# Altium project RX_V1.0.PrjPcb
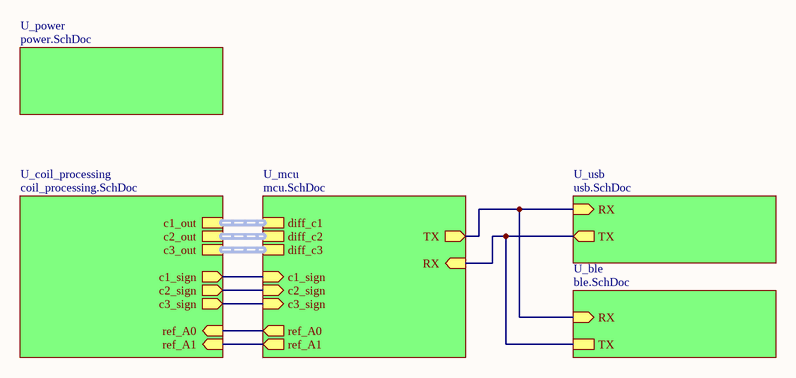
[diagram p0: rx.SchDoc]
8 sheets, 154 parts. Net scope: hierarchical (ports join the sheet entries above them; power ports are global).
Board file: RX.PcbDoc
Sheets:
  rx.SchDoc
    U_power = power.SchDoc
    U_mcu = mcu.SchDoc
      U_imu = imu.SchDoc
    U_coil_processing = coil_processing.SchDoc
      c1 = coils.SchDoc
      c2 = coils.SchDoc
      c3 = coils.SchDoc
    U_usb = usb.SchDoc
    U_ble = ble.SchDoc

## Sheet rx.SchDoc
size A

### Sub-sheets
U_ble = ble.SchDoc: RX (in), TX
U_coil_processing = coil_processing.SchDoc: c2_out (harness diff_signal), c3_sign (out), c2_sign (out), c3_out (harness diff_signal), c1_sign (out), c1_out (harness diff_signal), ref_A0 (in), ref_A1 (in)
U_mcu = mcu.SchDoc: diff_c1 (harness diff_signal), diff_c2 (harness diff_signal), diff_c3 (harness diff_signal), c1_sign (in), c2_sign (in), c3_sign (in), ref_A0 (out), ref_A1 (out), TX (out), RX (in)
U_power = power.SchDoc: no entries
U_usb = usb.SchDoc: TX (out), RX (in)

### Nets
RX: sheet U_mcu/RX, sheet U_usb/TX, sheet U_ble/TX
TX: sheet U_mcu/TX, sheet U_usb/RX, sheet U_ble/RX
NetRp1_1: sheet U_mcu/c1_sign, sheet U_coil_processing/c1_sign
NetRp2_1: sheet U_mcu/c2_sign, sheet U_coil_processing/c2_sign
NetRp3_1: sheet U_mcu/c3_sign, sheet U_coil_processing/c3_sign
NetU3_29: sheet U_mcu/ref_A0, sheet U_coil_processing/ref_A0
NetU3_30: sheet U_mcu/ref_A1, sheet U_coil_processing/ref_A1

### Buses and harness runs
harness sheet U_coil_processing/c1_out = sheet U_mcu/diff_c1
harness sheet U_coil_processing/c2_out = sheet U_mcu/diff_c2
harness sheet U_coil_processing/c3_out = sheet U_mcu/diff_c3

## Sheet power.SchDoc
size A
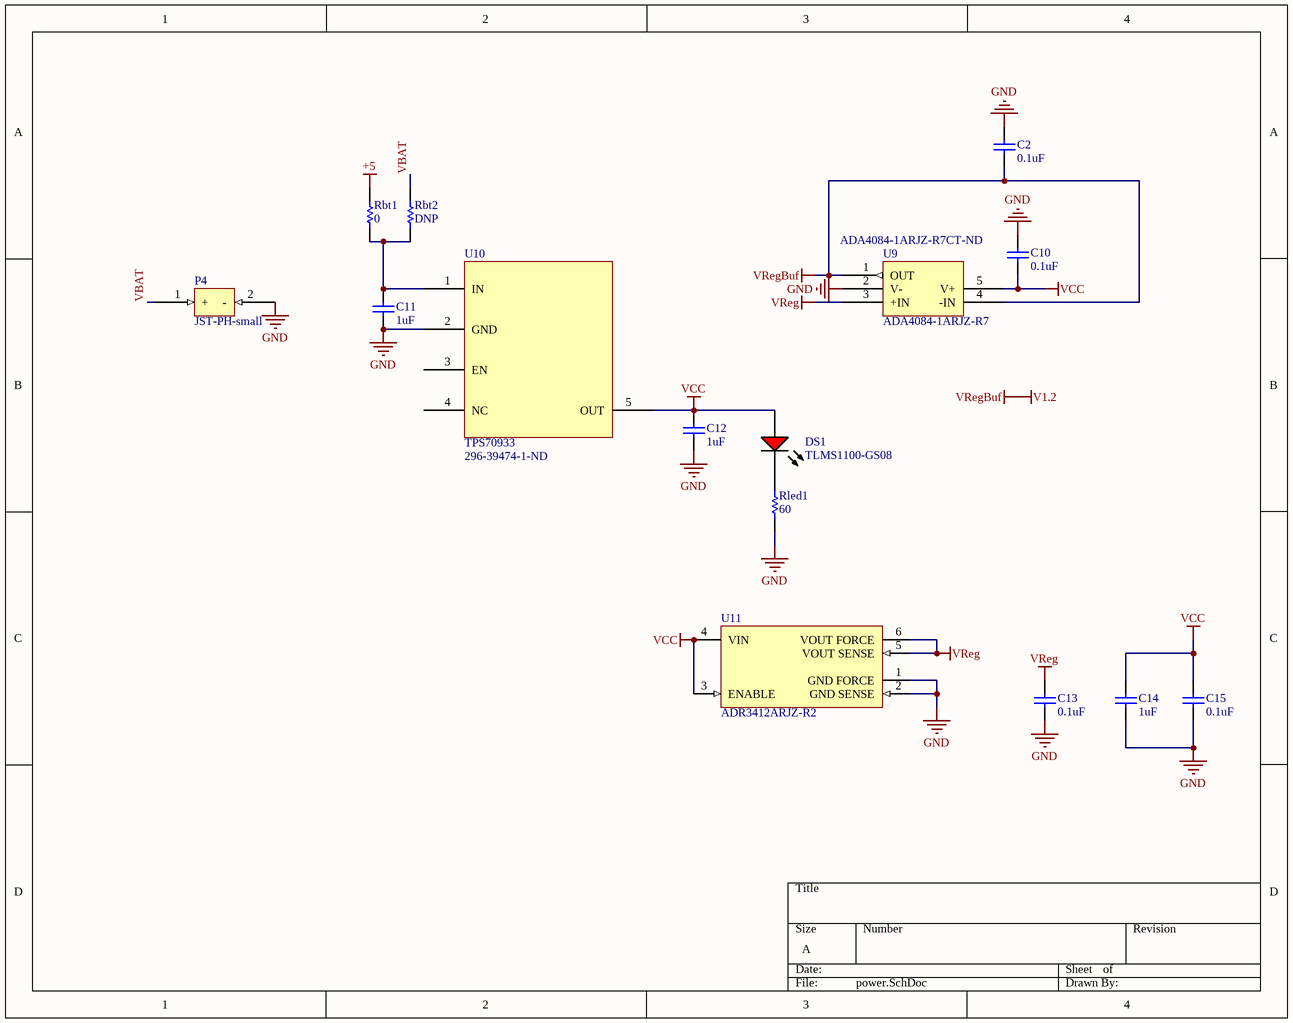
[diagram p1: power.SchDoc]

### Parts
C2  value 0.1uF  [0402]  (hidden comment: Cap)
C10  value 0.1uF  [0402]  (hidden comment: Cap)
C11  value 1uF  [0402]  (hidden comment: Cap)
C12  value 1uF  [0402]  (hidden comment: Cap)
C13  value 0.1uF  [0402]  (hidden comment: Cap)
C14  value 1uF  [0402]  (hidden comment: Cap)
C15  value 0.1uF  [0402]  (hidden comment: Cap)
DS1  TLMS1100-GS08  [VISH-TLMX1100_V]
P4  JST-PH-small  [JST-PH-small]
Rbt1  value 0  [0402]  (hidden comment: Res)
Rbt2  value DNP  [0402]  (hidden comment: Res)
Rled1  value 60  [0402]  (hidden comment: Res)
U9  ADA4084-1ARJZ-R7  Supplier Part Number 1: ADA4084-1ARJZ-R7CT-ND  [SOT95P280X145-5N]
U10  TPS70933  Supplier Part Number 1: 296-39474-1-ND  [SOT95P280X145-5N]
U11  ADR3412ARJZ-R2  [ADI-RJ-6_N]

### Nets
+5: Rbt1.2
GND: C2.2 C10.2 C11.2 C12.2 C13.1 C14.2 C15.1 P4.2(-) Rled1.1 U9.2(V-) U10.2(GND) U11.1(GND_FORCE) U11.2(GND_SENSE)
V1.2: C2.1 U9.1(OUT) U9.4(-IN)  [also labelled VRegBuf]
VCC: C10.1 C12.1 C14.1 C15.2 DS1.1(A) U9.5(V+) U10.5(OUT) U11.3(ENABLE) U11.4(VIN)
VReg: C13.2 U9.3(+IN) U11.5(VOUT_SENSE) U11.6(VOUT_FORCE)
VBAT: P4.1(+) Rbt2.2
NetC11_1: C11.1 Rbt1.1 Rbt2.1 U10.1(IN)
NetDS1_2: DS1.2(K) Rled1.2

Not connected (* = marked no-connect by the designer): U10 3(EN) 4(NC)

### Library data of the parts
C2 C10-C15 = Cap: Ceramic Capacitor (Surface Mount); Manufacturer: Generic Ceramic Chip Cap (TBD); Digi-Key Part Number: *; Manufacturer Part Number: *; Note: *; Rating: *
DS1 = CMP-1666-00027-1: LED, RED, 2.1 V, -40 to 100 degC, 2-Pin SMD (0603), RoHS, Tape and Reel; Type (Capacitors): C0G; Resistance: 100000000000 Ohm; Capacitance: 12 pF; Voltage Rating: 50 V; Tolerance: 5%; Min Operating Temperature: -55degC; REACH SVHC: No SVHC; ComponentLink2Description: Datasheet; ComponentLink1URL: http://www.vishay.com/; Width: 0.8 mm; Package Quantity: 4000; PackageReference: TLMX1100; ComponentLink2URL: http://www.vishay.com/docs/83173/tlmb1100.pdf; Case/Package: 0603; Case Code (Metric): 1608; Packaging: Tape and Reel; Pins: 2; ComponentLink1Description: Manufacturer URL; Max Operating Temperature: 125degC; Height: 0.8 mm; Length: 1.6 mm; Mount: Surface Mount; PackageDescription: 2-Pin Surface Mount Device, Body 1.6 x 0.8 mm; DatasheetVersion: Rev. 2.7, 03/2016; Case Code (Imperial): 0603; Voltage Rating (DC): 50 V; RoHSCompliant: True; Radiation Hardening: No
Rbt1 Rbt2 Rled1 = Res: Chip Resistor (Surface Mount); Manufacturer: Generic Chip Res (TBD); Manufacturer Part Number: *; Digi-Key Part Number: *; Rating: *
U9 = ADA4622-1ARJZ: 30 V, 8 MHz, Low Bias Current, / Single-Supply, RRO, Precision Op Amps; ComponentLink1Description: Datasheet; ComponentLink1URL: http://www.analog.com/media/en/technical-documentation/data-sheets/ada4622-1-4622-2-4622-4.pdf; Supplier 1: Digi-Key
U10 = TPS70933: 3.3V Ultra low power Voltage Regulator; Supplier 1: Digi-Key
U11 = CMP-0784-00363-1: Micropower, High Accuracy Voltage Reference, 1.2 V Output, 2.3 to 5.5 V Supply, Industrial, 6-pin SOT23 (RJ-6), Reel; Manufacturer: Analog Devices; Vout: 1.2V; Max V Supply (V): 5.5; Min V Supply (V): 2.3; Ref Out TC (ppm/C): 8; Mounting Technology: Surface Mount; DatasheetVersion: Rev. B; Code_JEDEC: MO-178-AB; ComponentLink3URL: http://www.analog.com/static/imported-files/packages/PKG_PDF/SOT-23(RJ)/RJ_6.pdf; ComponentLink2Description: Datasheet; ComponentLink1URL: http://www.analog.com/en/index.html; ComponentLink2URL: http://www.analog.com/static/imported-files/data_sheets/ADR3412_ADR3420_ADR3425_ADR3430_ADR3433_ADR3440_ADR3450.pdf; Packing: Reel; ComponentLink4Description: URL Link1; Operating Temp Range: -40 to 125 degC; ComponentLink4URL: Product URL:http://www.analog.com/en/special-linear-functions/voltage-references/adr3412/products/product.html; ComponentLink3Description: Package Specification; PartNumber: ADR3412ARJZ-R2; PackageReference: RJ-6; PackageVersion: 121608-A, 12/2008; ComponentLink1Description: Manufacturer URL; PackageDescription: 6-Pin Small Outline Transistor Package, Body 2.9 x 1.6 mm, Pitch 0.95 mm

## Sheet mcu.SchDoc
size A
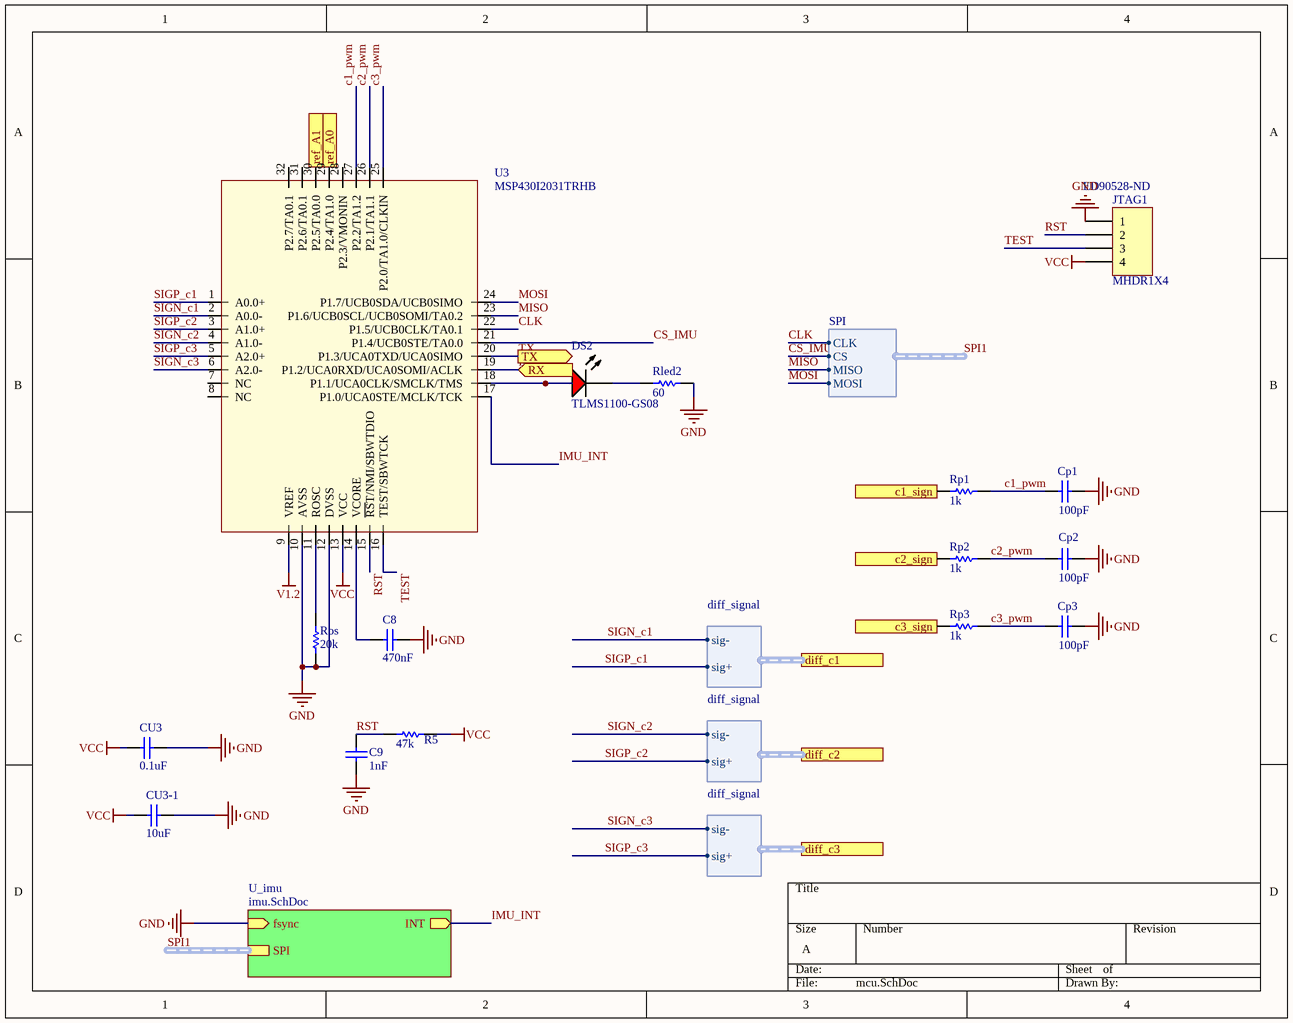
[diagram p2: mcu.SchDoc]

### Parts
C8  value 470nF  [0402]  (hidden comment: Cap)
C9  value 1nF  [0402]  (hidden comment: Cap)
Cp1  value 100pF  [0402]  (hidden comment: Cap)
Cp2  value 100pF  [0402]  (hidden comment: Cap)
Cp3  value 100pF  [0402]  (hidden comment: Cap)
CU3  value 0.1uF  [0402]  (hidden comment: Cap)
CU3-1  value 10uF  [0402]  (hidden comment: Cap)
DS2  TLMS1100-GS08  [VISH-TLMX1100_V]
JTAG1  MHDR1X4  Supplier Part Number 1: ED90528-ND  [MHDR1X4]
R5  value 47k  [0402]  (hidden comment: Res)
Rled2  value 60  [0402]  (hidden comment: Res)
Ros  value 20k  [0402]  (hidden comment: Res)
Rp1  value 1k  [0402]  (hidden comment: Res)
Rp2  value 1k  [0402]  (hidden comment: Res)
Rp3  value 1k  [0402]  (hidden comment: Res)
U3  MSP430I2031TRHB  [QFN50P500X500X100_HS-33N]

### Sub-sheets
U_imu = imu.SchDoc: fsync (in), INT (out), SPI (harness SPI)

### Ports
c1_sign (in), c2_sign (in), c3_sign (in), diff_c1 (harness diff_signal), diff_c2 (harness diff_signal), diff_c3 (harness diff_signal), ref_A0 (out), ref_A1 (out), RX (in), TX (out)

### Harnesses
SPI: CLK, CS, MISO, MOSI
diff_signal: sig+, sig-

### Nets
GND: C8.1 C9.1 Cp1.1 Cp2.1 Cp3.1 CU3.1 CU3-1.1 JTAG1.1 Rled2.2 Ros.1 U3.10(AVSS) U3.12(DVSS) ; sheet U_imu/fsync
V1.2: U3.9(VREF)
VCC: CU3.2 CU3-1.2 JTAG1.4 R5.2 U3.13(VCC)
c1_pwm: Cp1.2 Rp1.2 U3.27(P2.2/TA1.2)
c2_pwm: Cp2.2 Rp2.2 U3.26(P2.1/TA1.1)
c3_pwm: Cp3.2 Rp3.2 U3.25(P2.0/TA1.0/CLKIN)
CLK: U3.22(P1.5/UCB0CLK/TA0.1) ; sheet U_imu/SPI.CLK  [project net SPI1.CLK]
CS_IMU: U3.21(P1.4/UCB0STE/TA0.0) ; sheet U_imu/SPI.CS  [project net SPI1.CS]
IMU_INT: U3.17(P1.0/UCA0STE/MCLK/TCK) ; sheet U_imu/INT
MISO: U3.23(P1.6/UCB0SCL/UCB0SOMI/TA0.2) ; sheet U_imu/SPI.MISO  [project net SPI1.MISO]
MOSI: U3.24(P1.7/UCB0SDA/UCB0SIMO) ; sheet U_imu/SPI.MOSI  [project net SPI1.MOSI]
RST: C9.2 JTAG1.2 R5.1 U3.15(~{RS}T/NMI/SBWTDIO)
RX: U3.19(P1.2/UCA0RXD/UCA0SOMI/ACLK) ; port RX
SIGN_c1: U3.2(A0.0-) ; port diff_c1.sig-
SIGN_c2: U3.4(A1.0-) ; port diff_c2.sig-
SIGN_c3: U3.6(A2.0-) ; port diff_c3.sig-
SIGP_c1: U3.1(A0.0+) ; port diff_c1.sig+
SIGP_c2: U3.3(A1.0+) ; port diff_c2.sig+
SIGP_c3: U3.5(A2.0+) ; port diff_c3.sig+
TEST: JTAG1.3 U3.16(TEST/SBWTCK)
TX: U3.20(P1.3/UCA0TXD/UCA0SIMO) ; port TX
NetC8_2: C8.2 U3.14(VCORE)
NetDS2_1: DS2.1(A) U3.18(P1.1/UCA0CLK/SMCLK/TMS)
NetDS2_2: DS2.2(K) Rled2.1
NetRos_2: Ros.2 U3.11(ROSC)
NetRp1_1: Rp1.1 ; port c1_sign
NetRp2_1: Rp2.1 ; port c2_sign
NetRp3_1: Rp3.1 ; port c3_sign
NetU3_29: U3.29(P2.4/TA1.0) ; port ref_A0
NetU3_30: U3.30(P2.5/TA0.0) ; port ref_A1

Not connected (* = marked no-connect by the designer): U3 7(NC) 8(NC) 28(P2.3/VMONIN) 31(P2.6/TA0.1) 32(P2.7/TA0.1)

### Buses and harness runs
harness SPI1 = sheet U_imu/SPI

### Library data of the parts
C8 C9 Cp1-Cp3 CU3 CU3-1 = Cap: as C2 on sheet power; Digi-Key Part Number: *; Manufacturer Part Number: *; Note: *; Rating: *
DS2 = CMP-1666-00027-1: as DS1 on sheet power; Min Operating Temperature: -55degC; REACH SVHC: No SVHC; ComponentLink2Description: Datasheet; ComponentLink1URL: http://www.vishay.com/; Width: 0.8 mm; Package Quantity: 4000; PackageReference: TLMX1100; ComponentLink2URL: http://www.vishay.com/docs/83173/tlmb1100.pdf; Case/Package: 0603; Case Code (Metric): 1608; Packaging: Tape and Reel; Pins: 2; ComponentLink1Description: Manufacturer URL; Max Operating Temperature: 125degC; Height: 0.8 mm; Length: 1.6 mm; Mount: Surface Mount; PackageDescription: 2-Pin Surface Mount Device, Body 1.6 x 0.8 mm; DatasheetVersion: Rev. 2.7, 03/2016; Case Code (Imperial): 0603; Voltage Rating (DC): 50 V; RoHSCompliant: True; Radiation Hardening: No
JTAG1 = MHDR1X4: Header, 4-Pin; LatestRevisionDate: 17-Jul-2002; LatestRevisionNote: Re-released for DXP Platform.; Publisher: Altium Limited; Supplier 1: Digi-Key
R5 Rled2 Ros Rp1-Rp3 = Res: as Rbt1 on sheet power; Manufacturer Part Number: *; Digi-Key Part Number: *; Rating: *

## Sheet imu.SchDoc
size A
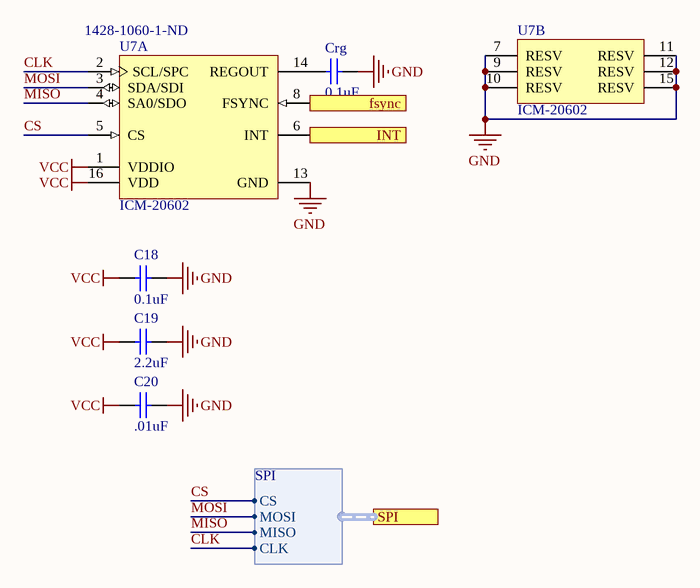
[diagram p3: imu.SchDoc]

### Parts
C18  value 0.1uF  [0402]  (hidden comment: Cap)
C19  value 2.2uF  [0402]  (hidden comment: Cap)
C20  value .01uF  [0402]  (hidden comment: Cap)
Crg  value 0.1uF  [0402]  (hidden comment: Cap)
U7  ICM-20602  Supplier Part Number 1: 1428-1060-1-ND  [INSE-I62-16]  (parts A,B of 2)

### Ports
fsync (in), INT (out), SPI (harness SPI)

### Harnesses
SPI: CS, MOSI, MISO, CLK

### Nets
GND: C18.2 C19.2 C20.2 Crg.2 U7.7(RESV) U7.8(FSYNC) U7.9(RESV) U7.10(RESV) U7.11(RESV) U7.12(RESV) U7.13(GND) U7.15(RESV) ; port fsync
VCC: C18.1 C19.1 C20.1 U7.1(VDDIO) U7.16(VDD)
CLK: U7.2(SCL/SPC) ; port SPI.CLK  [project net SPI1.CLK]
CS: U7.5(CS) ; port SPI.CS  [project net SPI1.CS]
IMU_INT: U7.6(INT) ; port INT
MISO: U7.4(SA0/SDO) ; port SPI.MISO  [project net SPI1.MISO]
MOSI: U7.3(SDA/SDI) ; port SPI.MOSI  [project net SPI1.MOSI]
NetCrg_1: Crg.1 U7.14(REGOUT)

### Library data of the parts
C18-C20 Crg = Cap: as C2 on sheet power; Digi-Key Part Number: *; Manufacturer Part Number: *; Note: *; Rating: *
U7 = CMP-2000-07589-1: High Performance 6-Axis MEMS MotionTracking(TM) Device, 1.71 to 3.45 V, -40 to 85 degC, 16-Pin LGA, RoHS; Manufacturer: InvenSense; Sensor Type: Temperature; Output Type: I2C; RoHSCompliant: True; Datasheet Version: Rev. 1.0, 10/2016; Datasheet URL: http://www.invensense.com/wp-content/uploads/2016/10/DS-000176-ICM-20602-v1.0.pdf; Min Operating Temperature: -40degC; Mounting Technology: SurfaceMount; Max Operating Temperature: 85degC; Manufacturer URL: http://www.invensense.com/; Package Reference: I62-16; Package Description: 16-Pin Land Grid Array, Body 3 x 3 mm, Pitch 0.5 mm; Supplier 1: Digi-Key

## Sheet coil_processing.SchDoc
size A
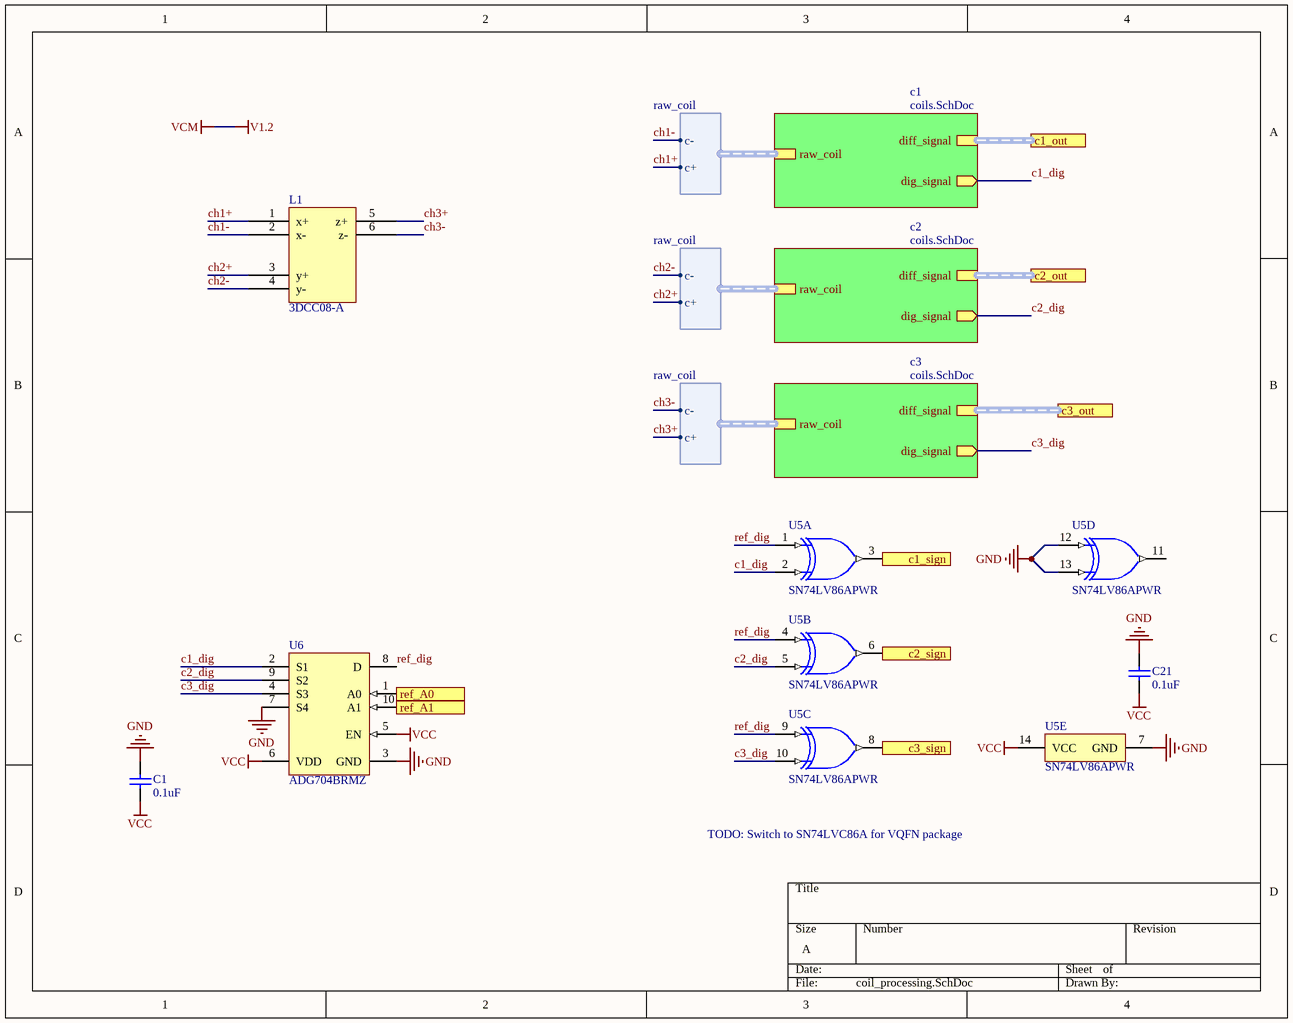
[diagram p4: coil_processing.SchDoc]

### Parts
C1  value 0.1uF  [0402]  (hidden comment: Cap)
C21  value 0.1uF  [0402]  (hidden comment: Cap)
L1  3DCC08-A  [3DCC08-A]
U5  SN74LV86APWR  [PW0014A_L]  (parts A,B,C,D,E of 5)
U6  ADG704BRMZ  [ADI-RM-10_N]

### Sub-sheets
c1 = coils.SchDoc: raw_coil (harness raw_coil), diff_signal (harness diff_signal), dig_signal (out)  | C1_val: 2200pF; C2_val: 100pF
c2 = coils.SchDoc: raw_coil (harness raw_coil), diff_signal (harness diff_signal), dig_signal (out)  | C1_val: 2200pF; C2_val: 100pF
c3 = coils.SchDoc: raw_coil (harness raw_coil), diff_signal (harness diff_signal), dig_signal (out)  | C1_val: 2200pF; C2_val: 100pF

### Ports
c1_out (harness diff_signal), c1_sign (out), c2_out (harness diff_signal), c2_sign (out), c3_out (harness diff_signal), c3_sign (out), ref_A0 (in), ref_A1 (in)

### Harnesses
raw_coil: c-, c+

### Nets
GND: C1.2 C21.2 U5.7(GND) U5.12(4A) U5.13(4B) U6.3(GND) U6.7(S4)
VCC: C1.1 C21.1 U5.14(VCC) U6.5(EN) U6.6(VDD)
c1_dig: U5.2(1B) U6.2(S1) ; sheet c1/dig_signal
c2_dig: U5.5(2B) U6.9(S2) ; sheet c2/dig_signal
c3_dig: U5.10(3B) U6.4(S3) ; sheet c3/dig_signal
ch1+: L1.1(x+) ; sheet c1/raw_coil.c+
ch1-: L1.2(x-) ; sheet c1/raw_coil.c-
ch2+: L1.3(y+) ; sheet c2/raw_coil.c+
ch2-: L1.4(y-) ; sheet c2/raw_coil.c-
ch3+: L1.5(z+) ; sheet c3/raw_coil.c+
ch3-: L1.6(z-) ; sheet c3/raw_coil.c-
ref_dig: U5.1(1A) U5.4(2A) U5.9(3A) U6.8(D)
NetRp1_1: U5.3(1Y) ; port c1_sign
NetRp2_1: U5.6(2Y) ; port c2_sign
NetRp3_1: U5.8(3Y) ; port c3_sign
NetU3_29: U6.1(A0) ; port ref_A0
NetU3_30: U6.10(A1) ; port ref_A1

Not connected (* = marked no-connect by the designer): U5 11(4Y)

### Buses and harness runs
harness port c1_out = sheet c1/diff_signal
harness port c2_out = sheet c2/diff_signal
harness port c3_out = sheet c3/diff_signal

### Notes on the sheet
- TODO: Switch to SN74LVC86A for VQFN package

### Library data of the parts
C1 C21 = Cap: as C2 on sheet power; Digi-Key Part Number: *; Manufacturer Part Number: *; Note: *; Rating: *
U5 = CMP-0778-00149-3: Quadruple 2-Input Exclusive-OR Gates, PW0014A, LARGE T&R; Manufacturer: Texas Instruments; Input Type: TTL; Schmitt Trigger: No; Bits(#): 4; Rating: Catalog; Voltage(Nom)(V): 2.5,3.3,5; Technology Family: LV-A; ICC @ Nom Voltage(Max)(mA): 0.02; Output Drive (IOL/IOH)(Max)(mA): 50/-50; F @ Nom Voltage(Max)(Mhz): 70; VCC(Max)(V): 5.5; tpd @ Nom Voltage(Max)(ns): 21,13,8; VCC(Min)(V): 2; Operating Temperature Range(C): -40 to 125,-40 to 85; Generic Part Number: SN74LV86A; PackageReference: PW0014A; Output Type: TTL; DatasheetVersion: SCLS392G
U6 = CMP-0798-00103-1: CMOS Low Voltage 4 Ohm, 4-Channel Multiplexer, -40 to 85 degC, 10-pin SOP (RM-10), Tube; Manufacturer: Analog Devices; Bandwidth (Hz): 200M; Supply V Guar Performance: Single_(+3.3V), Single_(+3V), Single_(+5V); Ron (ohms): 4; Max Analog Signal Range: 0 to Vdd; PackageDescription: 10-Pin Mini Small Outline Package, Body 3 x 3 mm, Pitch 0.5 mm; PackageVersion: Aug-05; Packing: Tube; PartNumber: ADG704BRMZ; ComponentLink3Description: Package Specification; ComponentLink3URL: http://www.analog.com/static/imported-files/packages/PKG_PDF/MSOP%28RM%29/RM_10.pdf; ComponentLink2Description: Datasheet; ComponentLink1URL: http://www.analog.com/en/index.html; ComponentLink1Description: Manufacturer URL; ComponentLink2URL: http://www.analog.com/static/imported-files/data_sheets/ADG704.pdf; Mounting Technology: Surface Mount; DatasheetVersion: Rev. A; Code_JEDEC: MO-187-BA; PackageReference: RM-10
L1 = 3DCC08-A: ComponentLink1Description: Premo; ComponentLink1URL: https://www.grupopremo.com/618-3dcc08-3d-coil-cube-receiver-sensor-for-vr-magnetic-tracking-system-165x148x118-mm-

## Sheet coils.SchDoc
size A
Used 3 times, as channels U_coil_processing/c1, U_coil_processing/c2, U_coil_processing/c3. Parts and nets are listed once, with the designators drawn on the sheet.
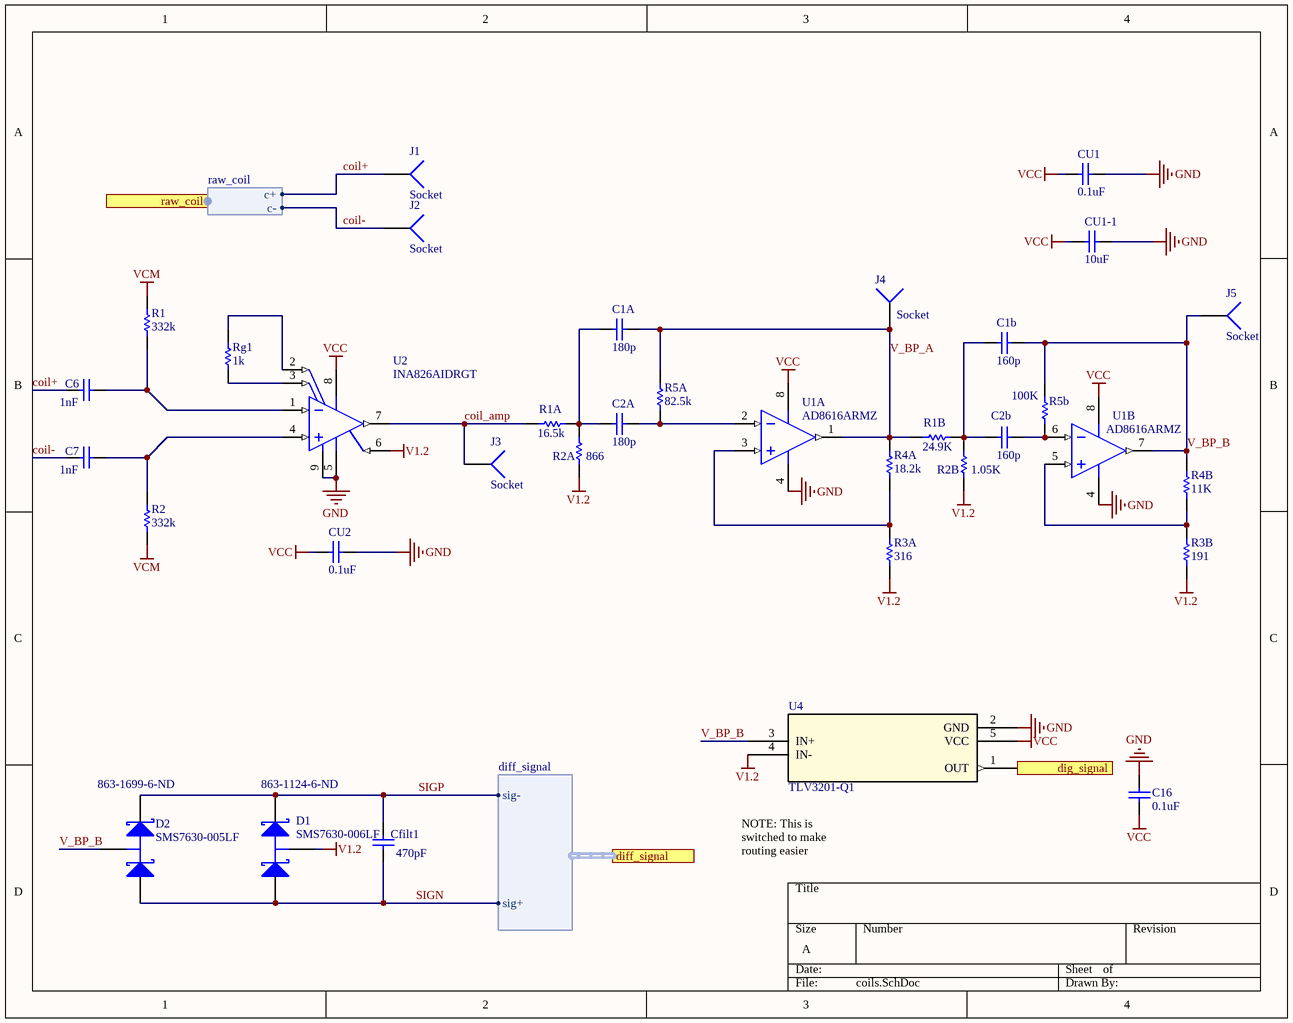
[diagram p5: coils.SchDoc]

### Parts
C1A  value 180p  [0402]  (hidden comment: Cap)
C1b  value 160p  [0402]  (hidden comment: Cap)
C2A  value 180p  [0402]  (hidden comment: Cap)
C2b  value 160p  [0402]  (hidden comment: Cap)
C6  value 1nF  [0402]  (hidden comment: Cap)
C7  value 1nF  [0402]  (hidden comment: Cap)
C16  value 0.1uF  [0402]  (hidden comment: Cap)
Cfilt1  value 470pF  [0402]  (hidden comment: Cap)
CU1  value 0.1uF  [0402]  (hidden comment: Cap)
CU1-1  value 10uF  [0402]  (hidden comment: Cap)
CU2  value 0.1uF  [0402]  (hidden comment: Cap)
D1  SMS7630-006LF  Supplier Part Number 1: 863-1124-6-ND  [SOT23-3N]
D2  SMS7630-005LF  Supplier Part Number 1: 863-1699-6-ND  [SOT23-3N]
J1  Socket  [pin1]
J2  Socket  [pin1]
J3  Socket  [pin1]
J4  Socket  [pin1]
J5  Socket  [pin1]
R1  value 332k  [0402]  (hidden comment: Res)
R1A  value 16.5k  [0402]  (hidden comment: Res)
R1B  value 24.9K  [0402]  (hidden comment: Res)
R2  value 332k  [0402]  (hidden comment: Res)
R2A  value 866  [0402]  (hidden comment: Res)
R2B  value 1.05K  [0402]  (hidden comment: Res)
R3A  value 316  [0402]  (hidden comment: Res)
R3B  value 191  [0402]  (hidden comment: Res)
R4A  value 18.2k  [0402]  (hidden comment: Res)
R4B  value 11K  [0402]  (hidden comment: Res)
R5A  value 82.5k  [0402]  (hidden comment: Res)
R5b  value 100K  [0402]  (hidden comment: Res)
Rg1  value 1k  [0402]  (hidden comment: Res)
U1  AD8616ARMZ  [ADI-RM-8_N]  (parts A,B of 2)
U2  INA826AIDRGT  [DRG0008A_V]
U4  TLV3201-Q1  [SOT95P280X145-5N]

### Ports
diff_signal (harness diff_signal), dig_signal (out), raw_coil (harness raw_coil)

### Harnesses
raw_coil: c-, c+
diff_signal: sig+, sig-

### Nets
GND: C16.2 CU1.1 CU1-1.1 CU2.1 U1.4(-V) U2.5(VS-) U2.9(EP) U4.2(GND)
V1.2: D1.3(C) R2A.1 R2B.1 R3A.2 R3B.1 U2.6(REF) U4.4(IN-)
VCC: C16.1 CU1.2 CU1-1.2 CU2.2 U1.8(+V) U2.8(VS+) U4.5(VCC)
VCM: R1.2 R2.1
coil+: C6.1 J1.1 ; port raw_coil.c+
coil-: C7.1 J2.1 ; port raw_coil.c-
coil_amp: J3.1 R1A.1 U2.7(VOUT)
dig_signal: U4.1(OUT) ; port dig_signal
SIGN: Cfilt1.1 D1.2(K) D2.1(A) ; port diff_signal.sig+
SIGP: Cfilt1.2 D1.1(A) D2.2(K) ; port diff_signal.sig-
V_BP_A: C1A.2 J4.1 R1B.1 R4A.1 R5A.1 U1.1(OUT_A)
V_BP_B: C1b.2 D2.3(C) J5.1 R4B.2 R5b.1 U1.7(OUT_B) U4.3(IN+)
NetC1A_1: C1A.1 C2A.1 R1A.2 R2A.2
NetC1b_1: C1b.1 C2b.1 R1B.2 R2B.2
NetC2A_2: C2A.2 R5A.2 U1.2(-IN_A)
NetC2b_2: C2b.2 R5b.2 U1.6(-IN_B)
NetC6_2: C6.2 R1.1 U2.1(IN-)
NetC7_2: C7.2 R2.2 U2.4(IN+)
NetR3A_1: R3A.1 R4A.2 U1.3(+IN_A)
NetR3B_2: R3B.2 R4B.1 U1.5(+IN_B)
NetRg1_1: Rg1.1 U2.2(RG)
NetRg1_2: Rg1.2 U2.3(RG)

### Channels
U_coil_processing/c1: designators end in _c1; ports dig_signal=c1_dig
U_coil_processing/c2: designators end in _c2; ports dig_signal=c2_dig
U_coil_processing/c3: designators end in _c3; ports dig_signal=c3_dig

### Notes on the sheet
- (near U4) NOTE: This is switched to make routing easier

### Library data of the parts
C1A C1b C2A C2b C6 C7 C16 Cfilt1 CU1 CU1-1 CU2 = Cap: as C2 on sheet power
  C1A C1b C2A C2b C16 Cfilt1 CU1 CU1-1 CU2: Digi-Key Part Number: *; Manufacturer Part Number: *; Note: *; Rating: *
D1 = SMS7621-006LF: Supplier 1: Digi-Key
D2 = SMS7621-005LF: Supplier 1: Digi-Key
R1 R1A R1B R2 R2A R2B R3A R3B R4A R4B R5A R5b Rg1 = Res: as Rbt1 on sheet power; Manufacturer Part Number: *; Digi-Key Part Number: *; Rating: *
U1 = CMP-0384-01709-1: Double Channel Wide Bandwidth Operational Amplifier, 24 MHz BW, 12 V/us SR, Industrial, 8-pin SOP (RM-8), Tube; Generic Part Number: AD8616; Manufacturer: Analog Devices; Amplifiers Per Package: 2; Small Signal Bandwidth: 24MHz; Input Offset Voltage: 23uV; Input Bias Current: 200fA; V Span Min: 2.7V; Iq/Amp: 2mA; Slew Rate: 12V/us; V Span Max: 6V; PackageDescription: 8-Pin Mini Small Outline Package, Body 3 x 3 mm, Pitch 0.65 mm; PartNumber: AD8616ARMZ; ComponentLink2URL: http://www.analog.com/static/imported-files/data_sheets/AD8615_8616_8618.pdf; ComponentLink3URL: http://www.analog.com/static/imported-files/packages/PKG_PDF/MSOP%28RM%29/RM_8.pdf; PackageReference: RM-8; Mounting Technology: Surface Mount; Code_JEDEC: MO-187-AA; ComponentLink1Description: Manufacturer URL; ComponentLink2Description: Datasheet; ComponentLink3Description: Package Specification; ComponentLink1URL: http://www.analog.com/en/index.html; DatasheetVersion: Rev. E; PartId: 1
U2 = CMP-0944-00099-2: Precision, 200-uA Supply Current, 36-V Supply Instrumentation Amplifier, -40 to 125 degC, 8-pin SON (DRG8), Green (RoHS & no Sb/Br); Manufacturer: Texas Instruments; Input Offset Drift (+/-)(Max)(uV/Degrees Celsius): 2; CMRR(Min)(dB): 84; Quiescent Current (+/-)(Typ)(mA): 0.2; Input Offset (+/-)(Max)(uV): 150; Output Offset Drift (+/-)(Max)(uV/Degrees Celsius): 10; Vs(Max)(V): 36; Non-Linearity (+/-)(Max)(%): 0.0005; Input Bias Current (+/-)(Max)(nA): 65; Number of Channels: 1; Noise at 1kHz(Typ)(nV/rt(Hz)): 18; SubFamily: Single Supply; Output Offset (+/-)(Max)(uV): 700; Gain(V/V): 1 to 1000; Vs(Min)(V): 2.7; PartNumber: INA826AIDRGT; PackageVersion: 4205379/C, 12/2010; DatasheetVersion: SBOS562E; Eco-Plan: Green (RoHS & no Sb/Br); Code_JEDEC: MO-229; ComponentLink2Description: Datasheet; ComponentLink3URL: http://www.ti.com/litv/pdf/mpds151b; ComponentLink2URL: http://www.ti.com/general/docs/lit/getliterature.tsp?genericPartNumber=INA826&fileType=pdf; Mounting Technology: Surface Mount; PackageReference: DRG0008A; PackageDescription: 8-Pin Plastic Small Outline, Body 3 x 3 mm, Pitch 0.5 mm; ComponentLink1Description: Manufacturer URL; ComponentLink1URL: http://www.ti.com/; ComponentLink3Description: Package Specification
U4 = TLV3201-Q1: 40-ns, Micropower Comparator; Supplier 1: Digi-Key; Supplier Part Number 1: 296-36750-1-ND
J1-J5 = Socket: LatestRevisionDate: 17-Jul-2002; LatestRevisionNote: Re-released for DXP Platform.; Publisher: Altium Limited

## Sheet usb.SchDoc
size A
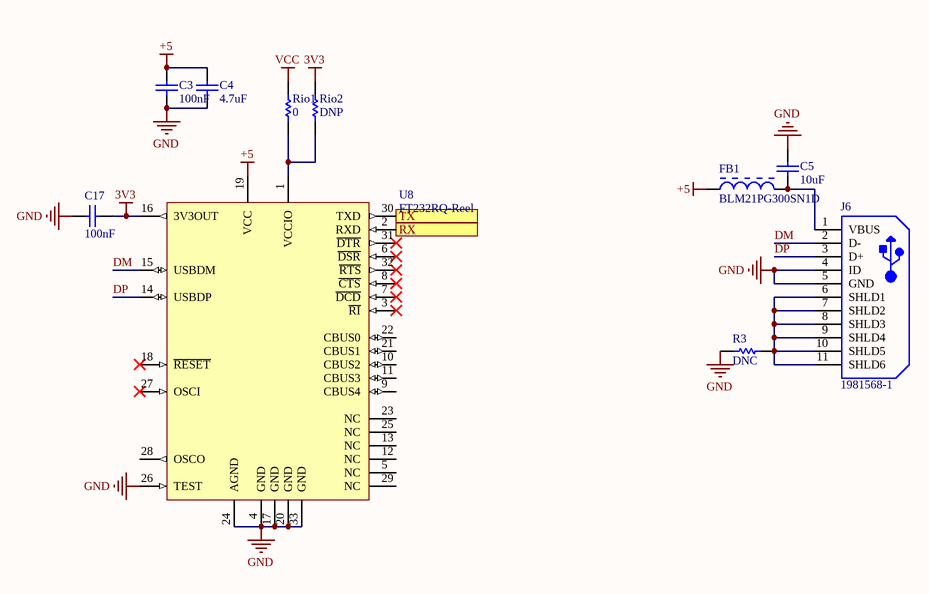
[diagram p6: usb.SchDoc]

### Parts
C3  value 100nF  [0402]  (hidden comment: Cap)
C4  value 4.7uF  [0402]  (hidden comment: Cap)
C5  value 10uF  [0402]  (hidden comment: Cap)
C17  value 100nF  [0402]  (hidden comment: Cap)
FB1  BLM21PG300SN1D  [MURA-BLM21-B40-CHIP-2_V2]
J6  1981568-1  [TECO-1981568-5_V]
R3  value DNC  [0402]  (hidden comment: Res)
Rio1  value 0  [0402]  (hidden comment: Res)
Rio2  value DNP  [0402]  (hidden comment: Res)
U8  FT232RQ-Reel  [PQFN5X5-32_V]

### Ports
RX (in), TX (out)

### Nets
3V3: C17.2 Rio2.2 U8.16(3V3OUT)
+5: C3.2 C4.2 FB1.1 U8.19(VCC)
GND: C3.1 C4.1 C5.2 C17.1 J6.4(ID) J6.5(GND) R3.1 U8.4(GND) U8.17(GND) U8.20(GND) U8.24(AGND) U8.26(TEST) U8.33(GND)
VCC: Rio1.2
DM: J6.2(D-) U8.15(USBDM)
DP: J6.3(D+) U8.14(USBDP)
RX: U8.30(TXD) ; port TX
TX: U8.2(RXD) ; port RX
NetC5_1: C5.1 FB1.2 J6.1(VBUS)
NetJ6_6: J6.6(SHLD1) J6.7(SHLD2) J6.8(SHLD3) J6.9(SHLD4) J6.10(SHLD5) J6.11(SHLD6) R3.2
NetRio1_1: Rio1.1 Rio2.1 U8.1(VCCIO)

Not connected (* = marked no-connect by the designer): U8 3(~{RI})* 5(NC) 6(~{DSR})* 7(~{DCD})* 8(~{CTS})* 9(CBUS4) 10(CBUS2) 11(CBUS3) 12(NC) 13(NC) 18(~{RESET})* 21(CBUS1) 22(CBUS0) 23(NC) 25(NC) 27(OSCI)* 28(OSCO) 29(NC) 31(~{DTR})* 32(~{RTS})*

### Library data of the parts
C3-C5 C17 = Cap: as C2 on sheet power; Digi-Key Part Number: *; Manufacturer Part Number: *; Note: *; Rating: *
FB1 = CMP-0686-00620-2: Chip Ferrite Bead for Power Lines, 30 Ohm, 4000 mA, -55 to 125 degC, 2 x 1.25 x 1.05 mm SMD, Tape and Reel; Manufacturer: Murata; DC Resistance: 0.014 Ohm Max.; Rated Current: 4000 mA; Impedance (at 100 MHz): 30 Ohm Typ.; ComponentLink3Description: Package Specification; Packing: Tape and Reel; ComponentLink3URL: http://www.murata.com/products/catalog/pdf/c31e.pdf; PackageDescription: 2-Pin Chip, Body 2 x 1.25 mm; DatasheetVersion: 08/2013; ComponentLink2Description: Datasheet; ComponentLink1Description: Manufacturer URL; PartNumber: BLM21PG300SN1D; PackageReference: BLM21_H1050-2; Mounting Technology: Surface Mount; ComponentLink1URL: http://www.murata.com/; Operating Temperature Range: -55 to 125 degC; ComponentLink2URL: http://www.murata.com/products/catalog/pdf/c31e.pdf
J6 = CMP-2000-05408-1: Micro USB Receptacle Standard Type B Assy, 5-Pin SMD, RoHS, Tape and Reel; Manufacturer: TE Connectivity; Body Orientation: RightAngle; Number of Ports: 1Port; Number of Contacts: 5POS; Gender: RCP; Voltage Rating Max: 30VAC; Product Depth (mm): 5.6mm; Pitch (mm): 0.65mm; Current Rating (Max): 1/ContactA; Product Length (mm): 8mm; Product Height (mm): 3mm; Operating Temperature Max Deg. C: 85C; Datasheet URL: http://www.mouser.com/ds/2/418/NG_CD_1981568_E2-621296.pdf; Termination Method: Solder; Number of Terminals: 5; Operating Temp Range: -55Cto85C; Mounting Style: SurfaceMount; Manufacturer URL: http://www.te.com/; Contact Material: CopperAlloy; Packaging: TapeandReel; Datasheet Version: Rev. E2, 08/2015; Operating Temperature Min Deg. C: -55C; Housing Material: Thermoplastic; Type: MicroUSB; Contact Plating: GoldOverNickel
R3 Rio1 Rio2 = Res: as Rbt1 on sheet power; Manufacturer Part Number: *; Digi-Key Part Number: *; Rating: *
U8 = CMP-0078-00009-3: USB UART Asynchronous Serial Data Transfer Chip, 32-pin QFN, Tape and Reel; Manufacturer: FTDI; ComponentLink1URL: http://www.ftdichip.com/; RevisionNote: DatasheetVersion updated to 2.10 Mar-2012; ComponentLink1Description: Manufacturer URL; PackageReference: PQFN5X5-32; PackageDescription: 32-Pin Quad Flat No-Lead 0.5 mm Pitch, Pullback, 3.2 x 3.2 mm Exposed Pad; DatasheetVersion: ver 2.10, Mar-2012; PartNumber: FT232RQ-Reel; ComponentLink2URL: http://www.ftdichip.com/Support/Documents/DataSheets/ICs/DS_FT232R.pdf; PackageVersion: Mar-12; ComponentLink2Description: Datasheet

## Sheet ble.SchDoc
size A
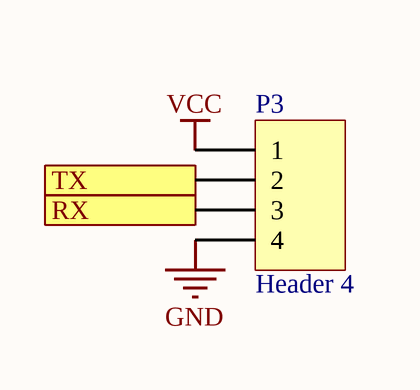
[diagram p7: ble.SchDoc]

### Parts
P3  Header 4  [HDR1X4]

### Ports
RX (in), TX (out)

### Nets
GND: P3.4
VCC: P3.1
RX: P3.2 ; port TX
TX: P3.3 ; port RX

### Library data of the parts
P3 = Header 4: Header, 4-Pin; LatestRevisionDate: 17-Jul-2002; LatestRevisionNote: Re-released for DXP Platform.; Publisher: Altium Limited

## Nets that join several sheets
+5: power (Rbt1.2), usb (C3.2 C4.2 FB1.1 U8.19)
GND: power (13 pins), mcu (12 pins), imu (12 pins), coil_processing (7 pins), U_coil_processing/c1 (8 pins), U_coil_processing/c2 (8 pins), U_coil_processing/c3 (8 pins), usb (13 pins), ble (P3.4)
V1.2: power (C2.1 U9.1 U9.4), mcu (U3.9), U_coil_processing/c1 (9 pins), U_coil_processing/c2 (9 pins), U_coil_processing/c3 (9 pins)
VCC: power (9 pins), mcu (5 pins), imu (5 pins), coil_processing (5 pins), U_coil_processing/c1 (7 pins), U_coil_processing/c2 (7 pins), U_coil_processing/c3 (7 pins), usb (Rio1.2), ble (P3.1)
c1_dig: coil_processing (U5.2 U6.2), U_coil_processing/c1 (U4_c1.1)
c2_dig: coil_processing (U5.5 U6.9), U_coil_processing/c2 (U4_c2.1)
c3_dig: coil_processing (U5.10 U6.4), U_coil_processing/c3 (U4_c3.1)
ch1+: coil_processing (L1.1), U_coil_processing/c1 (C6_c1.1 J1_c1.1)
ch1-: coil_processing (L1.2), U_coil_processing/c1 (C7_c1.1 J2_c1.1)
ch2+: coil_processing (L1.3), U_coil_processing/c2 (C6_c2.1 J1_c2.1)
ch2-: coil_processing (L1.4), U_coil_processing/c2 (C7_c2.1 J2_c2.1)
ch3+: coil_processing (L1.5), U_coil_processing/c3 (C6_c3.1 J1_c3.1)
ch3-: coil_processing (L1.6), U_coil_processing/c3 (C7_c3.1 J2_c3.1)
IMU_INT: mcu (U3.17), imu (U7.6)
NetRp1_1: mcu (Rp1.1), coil_processing (U5.3)
NetRp2_1: mcu (Rp2.1), coil_processing (U5.6)
NetRp3_1: mcu (Rp3.1), coil_processing (U5.8)
NetU3_29: mcu (U3.29), coil_processing (U6.1)
NetU3_30: mcu (U3.30), coil_processing (U6.10)
RX: mcu (U3.19), usb (U8.30), ble (P3.2)
SIGN_c1: mcu (U3.2), U_coil_processing/c1 (Cfilt1_c1.2 D1_c1.1 D2_c1.2)
SIGN_c2: mcu (U3.4), U_coil_processing/c2 (Cfilt1_c2.2 D1_c2.1 D2_c2.2)
SIGN_c3: mcu (U3.6), U_coil_processing/c3 (Cfilt1_c3.2 D1_c3.1 D2_c3.2)
SIGP_c1: mcu (U3.1), U_coil_processing/c1 (Cfilt1_c1.1 D1_c1.2 D2_c1.1)
SIGP_c2: mcu (U3.3), U_coil_processing/c2 (Cfilt1_c2.1 D1_c2.2 D2_c2.1)
SIGP_c3: mcu (U3.5), U_coil_processing/c3 (Cfilt1_c3.1 D1_c3.2 D2_c3.1)
SPI1.CLK: mcu (U3.22), imu (U7.2)
SPI1.CS: mcu (U3.21), imu (U7.5)
SPI1.MISO: mcu (U3.23), imu (U7.4)
SPI1.MOSI: mcu (U3.24), imu (U7.3)
TX: mcu (U3.20), usb (U8.2), ble (P3.3)